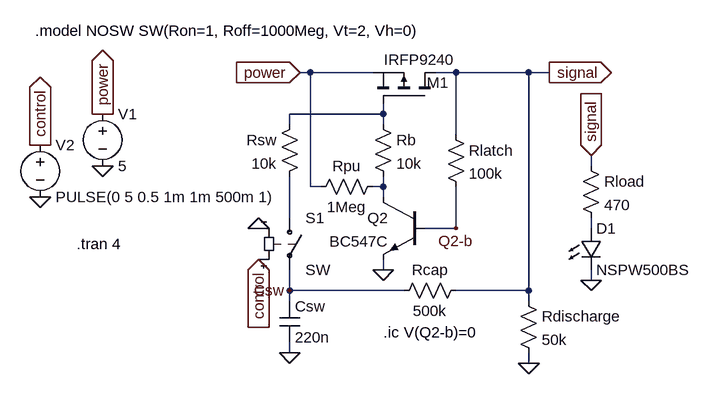
[diagram p0: schematic latch-toggle-npn-pmos.asc]
latch-toggle-npn-pmos.asc, the LTspice schematic file:
Version 4
SHEET 1 1184 680
WIRE 400 64 384 64
WIRE 496 64 400 64
WIRE 624 64 592 64
WIRE 736 64 624 64
WIRE 768 64 736 64
WIRE 512 128 512 112
WIRE 512 128 368 128
WIRE 368 144 368 128
WIRE 512 144 512 128
WIRE 624 160 624 64
WIRE 832 208 832 192
WIRE 400 240 400 64
WIRE 416 240 400 240
WIRE 512 240 512 224
WIRE 512 240 496 240
WIRE 512 256 512 240
WIRE 368 288 368 224
WIRE 624 304 624 240
WIRE 624 304 576 304
WIRE 832 304 832 288
WIRE 512 368 512 352
WIRE 832 384 832 368
WIRE 368 400 368 368
WIRE 544 400 368 400
WIRE 736 400 736 64
WIRE 736 400 624 400
WIRE 368 416 368 400
WIRE 736 416 736 400
WIRE 368 496 368 480
WIRE 736 512 736 496
FLAG 512 368 0
FLAG 384 64 power
IOPIN 384 64 In
FLAG 768 64 signal
IOPIN 768 64 Out
FLAG 832 384 0
FLAG 832 192 signal
IOPIN 832 192 In
FLAG 80 208 0
FLAG 80 128 power
IOPIN 80 128 Out
FLAG -16 256 0
FLAG -16 176 control
IOPIN -16 176 Out
FLAG 320 352 control
IOPIN 320 352 In
FLAG 320 304 0
FLAG 624 304 Q2-b
FLAG 368 496 0
FLAG 368 400 Csw
FLAG 736 512 0
SYMBOL npn 576 256 M0
SYMATTR InstName Q2
SYMATTR Value BC547C
SYMBOL Res 608 144 R0
SYMATTR InstName Rlatch
SYMATTR Value 100k
SYMBOL Res 816 192 R0
SYMATTR InstName Rload
SYMATTR Value 470
SYMBOL Voltage 80 112 R0
SYMATTR InstName V1
SYMATTR Value 5
SYMBOL Voltage -16 160 R0
SYMATTR InstName V2
SYMATTR Value PULSE(0 5 0.5 1m 1m 500m 1)
SYMBOL sw 368 272 R0
SYMATTR InstName S1
SYMATTR SpiceModel NOSW
SYMBOL Res 496 128 R0
SYMATTR InstName Rb
SYMATTR Value 10k
SYMBOL pmos 592 112 M270
WINDOW 0 32 13 VLeft 2
WINDOW 3 68 79 VLeft 2
SYMATTR InstName M1
SYMATTR Value IRFP9240
SYMBOL Res 512 224 R90
WINDOW 0 0 56 VBottom 2
WINDOW 3 32 56 VTop 2
SYMATTR InstName Rpu
SYMATTR Value 1Meg
SYMBOL Cap 352 416 R0
SYMATTR InstName Csw
SYMATTR Value 220n
SYMBOL Res 640 384 R90
WINDOW 0 0 56 VBottom 2
WINDOW 3 32 56 VTop 2
SYMATTR InstName Rcap
SYMATTR Value 500k
SYMBOL LED 816 304 R0
SYMATTR InstName D1
SYMATTR Value NSPW500BS
SYMATTR Description Diode
SYMATTR Type diode
SYMBOL Res 720 400 R0
SYMATTR InstName Rdischarge
SYMATTR Value 50k
SYMBOL Res 384 128 M0
SYMATTR InstName Rsw
SYMATTR Value 10k
TEXT -24 0 Left 2 !.model NOSW SW(Ron=1, Roff=1000Meg, Vt=2, Vh=0)
TEXT 40 328 Left 2 !.tran 4
TEXT 512 464 Left 2 !.ic V(Q2-b)=0

The netlist it stands for:
* latch-toggle-npn-pmos.asc
Q2 N002 Q2-b 0 0 BC547C
Rlatch signal Q2-b 100k
Rload signal N004 470
V1 power 0 5
V2 control 0 PULSE(0 5 0.5 1m 1m 500m 1)
S1 N003 Csw control 0 NOSW SW
Rb N001 N002 10k
M1 signal N001 power power IRFP9240
Rpu N002 power 1Meg
Csw Csw 0 220n
Rcap signal Csw 500k
D1 N004 0 NSPW500BS
Rdischarge signal 0 50k
Rsw N001 N003 10k
.model D D
.lib standard.dio
.model NPN NPN
.model PNP PNP
.lib standard.bjt
.model NMOS NMOS
.model PMOS PMOS
.lib standard.mos
.model NOSW SW(Ron=1, Roff=1000Meg, Vt=2, Vh=0)
.tran 4
.ic V(Q2-b)=0
.backanno
.end